# EAGLE design ESP8266 IOT Board v1.0 (EAGLE 7.7.0)
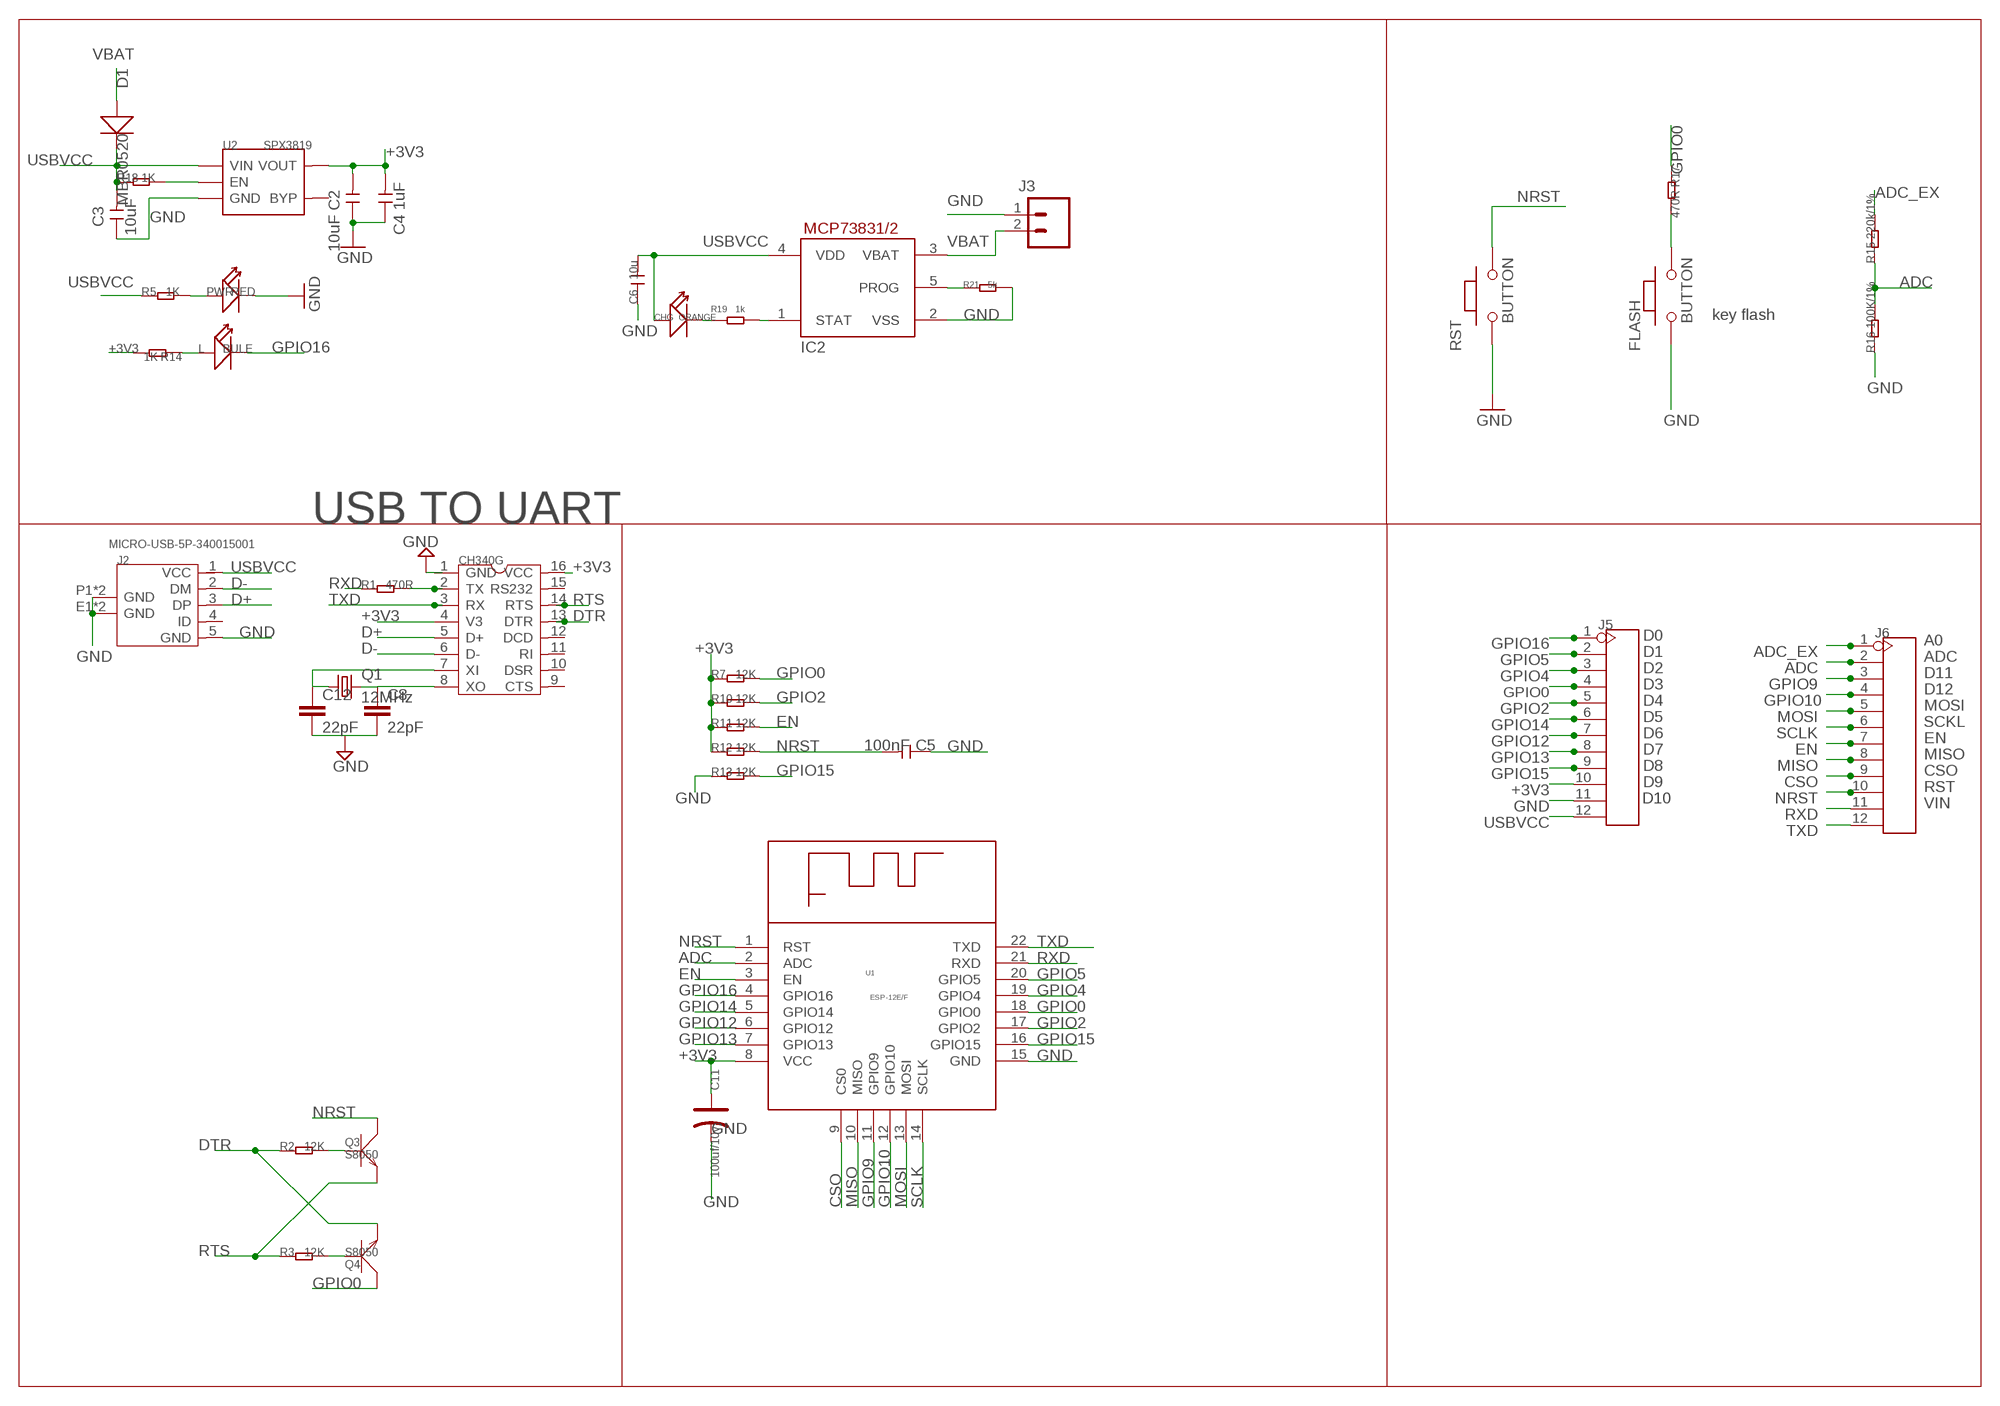
[diagram p0: schematic, sheet 1]

## Parts
C2  10uF  C-0603  [C0603]
C3  10uF  C-0603  [C0603]
C4  1uF  C-0603  [C0603]
C5  100nF  C-0603  [C0603]
C6  10u  C-0603  [C0603]
C8  22pF  CAP0603-CAP  [0603-CAP]
C11  100uf/10v  CAP-AVX-B  [AVX-B]
C12  22pF  CAP0603-CAP  [0603-CAP]
CH340G  CH340GCH340G  [SOP-16]
CHG  ORANGE  007-LED0603  [D0603]
D1  MBR0520  D'1206'  [SOD123]
FLASH  BUTTON  PB157  [157SW]
IC2  MCP73831/OT  [SOT23-5L]
J2  MICRO-USB-5P-340015001  [B-SMD-5P]
J3  M02-JST-2MM-SMT  [JST-2-SMD]
J5  HEADER-12P-2.54  [12P-2.54]
J6  HEADER-12P-2.54  [12P-2.54]
L  BULE  LED'0603'  [LED-0603]
PWR  RED  LED'0603'  [LED-0603]
Q1  12MHz  CRYSTALHC49U70  [HC49U70]
Q3  S8050  TRANSISTOR-NPN-SOT23  [SOT23]
Q4  S8050  TRANSISTOR-NPN-SOT23  [SOT23]
R1  470R  R-0603  [R0603]
R2  12K  R-0603  [R0603]
R3  12K  R-0603  [R0603]
R5  1K  R-0603  [R0603]
R7  12K  R-0603  [R0603]
R10  12K  R-0603  [R0603]
R11  12K  R-0603  [R0603]
R12  12K  R-0603  [R0603]
R13  12K  R-0603  [R0603]
R14  1K  R-0603  [R0603]
R15  220k/1%  R-0603  [R0603]
R16  100K/1%  R-0603  [R0603]
R17  470R  R-0603  [R0603]
R18  1K  R-0603  [R0603]
R19  1k  R-0603  [R0603]
R21  5k  R-0603  [R0603]
RST  BUTTON  PB157  [157SW]
U1  ESP-12E/F  [ESP-12E/F]
U2  SPX3819  [SOT23-5]

## Nets
+3V3: C2.2 C4.2 C11.+ CH340G.4(V3) CH340G.16(VCC) J5.10 R7.1 R10.1 R11.1 R12.1 R14.2 U1.8(VCC) U2.5(VOUT)
ADC: J6.2 R15.1 R16.2 U1.2(ADC)
ADC_EX: J6.1 R15.2
CSO: J6.9 U1.9(CS0)
D+: CH340G.5(D+) J2.3(DP)
D-: CH340G.6(D-) J2.2(DM)
DTR: CH340G.13(DTR) Q4.2(E) R2.1
EN: J6.7 R11.2 U1.3(EN)
GND: C2.1 C3.1 C4.1 C5.1 C6.1 C8.2 C11.- C12.2 CH340G.1(GND) FLASH.1 IC2.2(VSS) J2.5(GND) J2.E1(GND) J2.E2(GND) J2.P1(GND) J2.P2(GND) J3.1 J5.11 PWR.- R13.1 R16.1 R21.2 RST.1 U1.15(GND) U2.2(GND)
GPIO0: J5.4 Q4.3(C) R7.2 R17.1 U1.18(GPIO0)
GPIO2: J5.5 R10.2 U1.17(GPIO2)
GPIO4: J5.3 U1.19(GPIO4)
GPIO5: J5.2 U1.20(GPIO5)
GPIO9: J6.3 U1.11(GPIO9)
GPIO10: J6.4 U1.12(GPIO10)
GPIO12: J5.7 U1.6(GPIO12)
GPIO13: J5.8 U1.7(GPIO13)
GPIO14: J5.6 U1.5(GPIO14)
GPIO15: J5.9 R13.2 U1.16(GPIO15)
GPIO16: J5.1 L.- U1.4(GPIO16)
MISO: J6.8 U1.10(MISO)
MOSI: J6.5 U1.13(MOSI)
N$1: CHG.- R19.1
N$2: L.+ R14.1
N$3: PWR.+ R5.2
N$4: CH340G.2(TX) R1.2
N$5: R18.2 U2.3(EN)
N$8: FLASH.2 R17.2
N$9: Q3.1(B) R2.2
N$10: Q4.1(B) R3.2
N$20: IC2.1(STAT) R19.2
N$31: IC2.5(PROG) R21.1
NRST: C5.2 J6.10 Q3.3(C) R12.2 RST.2 U1.1(RST)
RTS: CH340G.14(RTS) Q3.2(E) R3.1
RXD: J6.11 R1.1 U1.21(RXD)
SCLK: J6.6 U1.14(SCLK)
TXD: CH340G.3(RX) J6.12 U1.22(TXD)
USBVCC: C3.2 C6.2 CHG.+ D1.- IC2.4(VDD) J2.1(VCC) J5.12 R5.1 R18.1 U2.1(VIN)
VBAT: D1.+ IC2.3(VBAT) J3.2
XI: C12.1 CH340G.7(XI) Q1.1
XO: C8.1 CH340G.8(XO) Q1.2
Unconnected: CH340G.9(CTS) CH340G.10(DSR) CH340G.11(RI) CH340G.12(DCD) CH340G.15(RS232) J2.4(ID) U2.4(BYP)

## Notes on the sheet
- 10k=100mA
- 5k=200mA
- 2k=500mA
- 1k=1000mA | key flash
- USB TO UART
- D0
- D1 | A0
- D2 | ADC
- D3 | D11
- D4 | D12
- D5 | MOSI
- D6 | SCKL
- D7 | EN
- D8 | MISO
- D9 | CSO
- D10 | RST
- VIN

## Library data of the parts
C2-C6 = Discrete:C*: Ceramic Capacitors
C8 C12 = SparkFun-Capacitors:CAP: Capacitor Standard 0603 ceramic capacitor, and 0.1" leaded capacitor.
C11 = Discrete:CAP*: Electrolytic Capacitors,Tantalum Capacitors and Super Capacitors
CH340G = digital-ic:CH340G: USB to Serial CH340G
CHG = Discrete:007-LED*
D1 = Discrete:D*
FLASH RST = MySMD:PB157
IC2 = adafruit:MCP73831: MCP73831/2 Miniature Single-Cell, Fully Integrated Li-Ion, Li-Polymer Charge Management Controllers. Nice and small simple lipoly charge controller, with adjustable current and status output (LED) http://www.ladyada.net/library/pcb/eaglelibrary.html
J2 = OPL Eagle Library:MICRO-USB-5P: ST-USB-001E：MICRO USB B SMD R/A
J3 = SparkFun:M02: Header 2 Standard 2-pin 0.1" header. Use with straight break away headers (SKU : PRT-00116), right angle break away headers (PRT-00553), swiss pins (PRT-00743), machine pins (PRT-00117), and female headers (PRT-00115). Molex polarized connector foot print use with SKU : PRT-08233 with associated crimp pins and housings.
J5 J6 = Connector:HEADER-12P
L PWR = Discrete:LED*
Q1 = crystal:CRYSTAL: CRYSTAL; OC_FARNELL: unknown; OC_NEWARK: unknown
Q3 Q4 = Discrete:TRANSISTOR-NPN*: NPN audion
R1-R3 R5 R7 R10-R19 R21 = Discrete:R*
U1 = Discrete:ESP-12E/F
U2 = IC:SPX3819

## Net classes
1 power: width 0.61 mm, drill 0.61 mm, clearance 0.254 mm
2 gnd: width 0.305 mm, drill 0.559 mm, clearance 0.254 mm
3 usbvcc: width 0.254 mm, drill 0.61 mm, clearance 0.254 mm
4 aref: width 0.406 mm, drill 0.61 mm, clearance 0.254 mm

## Board
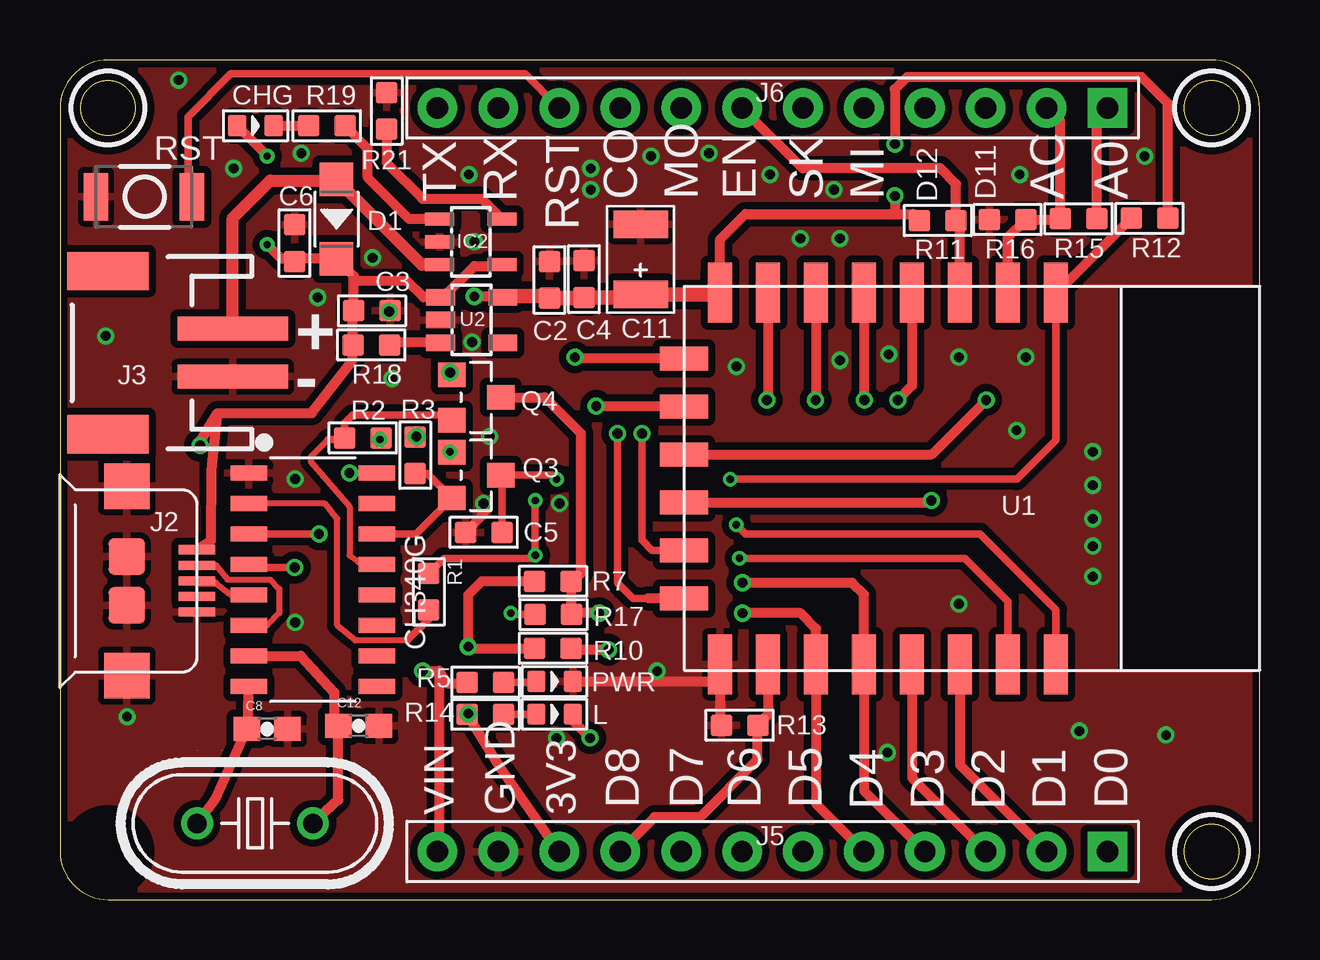
[diagram p1: board, top side]
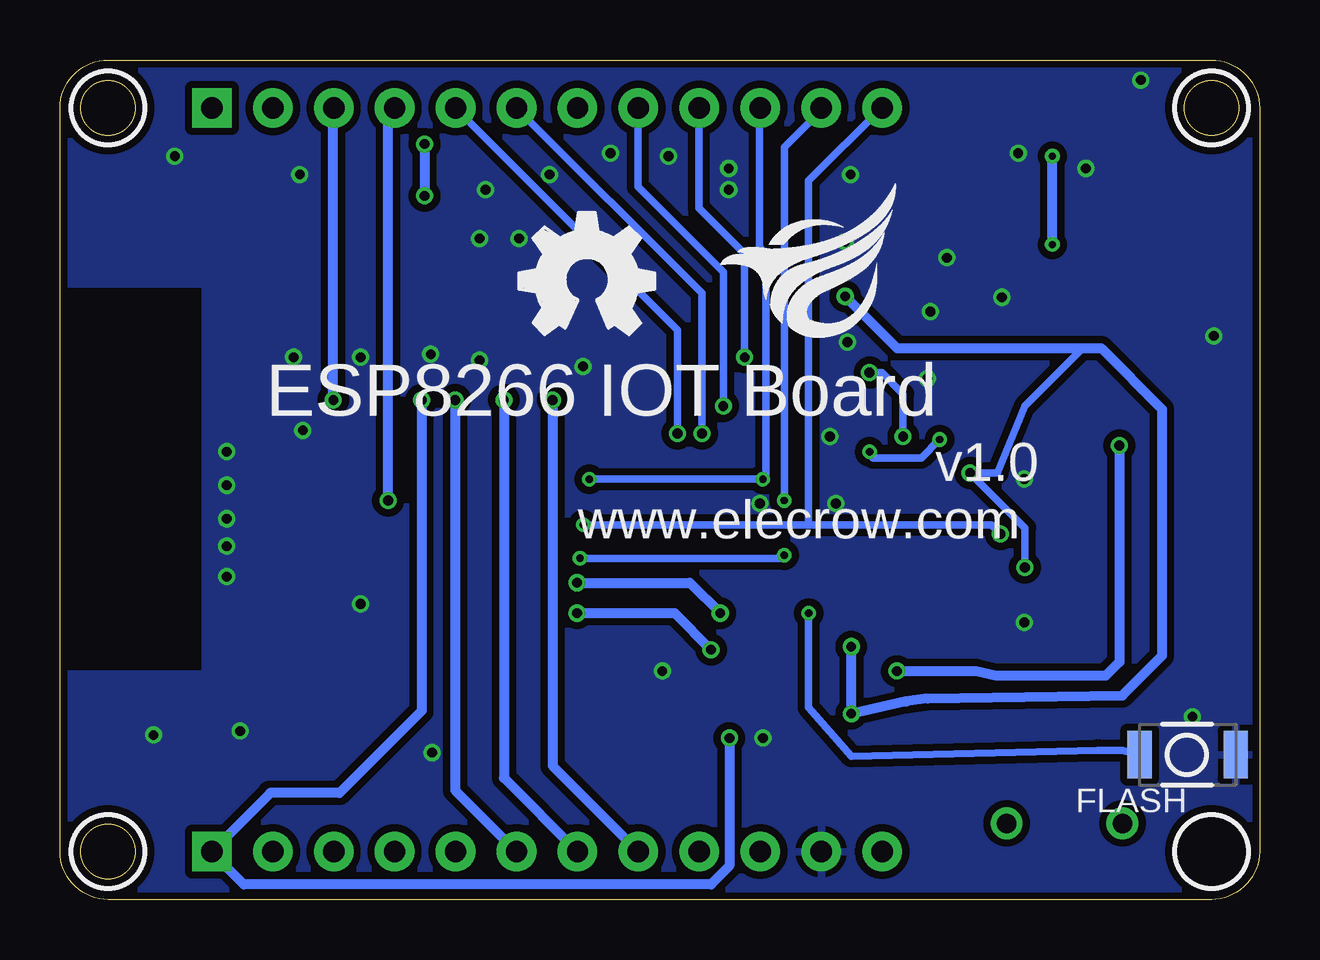
[diagram p2: board, bottom side, seen from below]

Size 50 x 35 mm. Coordinates in mm from the lower left corner, seen from the top.
Outline: 0,33 0,2 arc90 2,0 48,0 arc90 50,2 50,33 arc90 48,35 2,35 arc90 0,33
Outline: circle at 2,33 radius 1.14
Outline: circle at 48,33 radius 1.14
Outline: circle at 48,2 radius 1.14
Copper layers (1*16): Top 0.035mm / dielectric 1.5mm / Bottom 0.035mm
Design rules "SeeedStudio_2layer_DRU_no_angle_20140221": minimum track width 6mil, minimum drill 12mil, track to track 6mil, track to pad 6mil, pad to pad 6mil, via to via 6mil, smd to smd 0mil, copper to edge 10mil, drill to drill 10mil, minimum pad ring 10mil, minimum via ring 6mil, stop-mask expansion 2mil, vias tented up to drill 100mil, thermal gap 10mil
tRestrict: area 0.5,31.5 to 3.5,34.5; area 46.5,31.5 to 49.5,34.5; area 46.5,0.5 to 49.5,3.5; area 0.5,0.5 to 3.5,3.5
bRestrict: area 0.5,31.5 to 3.5,34.5; area 46.5,31.5 to 49.5,34.5; area 46.5,0.5 to 49.5,3.5; area 0.5,0.5 to 3.5,3.5

### Footprints (pad centres in the part's own frame; a part is rotated, then mirrored left to right if it is on the bottom)
C0603 = smd 0.889 x 0.889: 1 -0.762,0; 2 0.762,0
0603-CAP = smd 1.1 x 1: 1 -0.85,0; 2 0.85,0
AVX-B = smd 1.143 x 2.286: + -1.46,0; - 1.46,0
SOP-16 = smd 0.635 x 1.524: 1 -4.445,-2.667; 2 -3.175,-2.667; 3 -1.905,-2.667; 4 -0.635,-2.667; 5 0.635,-2.667; 6 1.905,-2.667; 7 3.175,-2.667; 8 4.445,-2.667; 9 4.445,2.667; 10 3.175,2.667; 11 1.905,2.667; 12 0.635,2.667; 13 -0.635,2.667; 14 -1.905,2.667; 15 -3.175,2.667; 16 -4.445,2.667
D0603 = smd 0.762 x 0.889: + -0.762,0; - 0.762,0
SOD123 = smd 1.397 x 1.397: + -1.651,0; - 1.651,0
157SW = smd 1.016 x 1.981: 1 0,0; 2 4,0
SOT23-5L = smd 0.55 x 1.2: 1 -0.95,-1.3; 2 0,-1.3; 3 0.95,-1.3; 4 0.95,1.3; 5 -0.95,1.3
B-SMD-5P = smd 0.38 x 1.52: 1 -1.3,2.54; 2 -0.65,2.54; 3 0,2.54; 4 0.65,2.54; 5 1.3,2.54 | smd 1.524 x 1.524: E1 -1.016,-0.381; E2 1.016,-0.381 | smd 1.9 x 1.9: P1 -3.95,-0.381; P2 3.95,-0.381
JST-2-SMD = smd 1 x 4.6: 1 -1,-3.7; 2 1,-3.7 | smd 1.6 x 3.4: NC1 -3.4,1.5; NC2 3.4,1.5
12P-2.54 = drill 0.889 pad 1.651 square: 1 0,13.97 | drill 0.889 pad 1.651: 2 0,11.43; 3 0,8.89; 4 0,6.35; 5 0,3.81; 6 0,1.27; 7 0,-1.27; 8 0,-3.81; 9 0,-6.35; 10 0,-8.89; 11 0,-11.43; 12 0,-13.97
LED-0603 = smd 0.762 x 0.889: + -0.762,0; - 0.762,0
HC49U70 = drill 0.813: 1 -2.413,0; 2 2.413,0
SOT23 = smd 1.016 x 1.143: 1 -0.95,-1.016; 2 0.95,-1.016; 3 0,1.016
R0603 = smd 0.889 x 0.889: 1 -0.762,0; 2 0.762,0
ESP-12E/F = smd 2.5 x 1: 1 0.25,15.5; 2 0.25,13.5; 3 0.25,11.5; 4 0.25,9.5; 5 0.25,7.5; 6 0.25,5.5; 7 0.25,3.5; 8 0.25,1.5; 15 15.75,1.5; 16 15.75,3.5; 17 15.75,5.5; 18 15.75,7.5; 19 15.75,9.5; 20 15.75,11.5; 21 15.75,13.5; 22 15.75,15.5 | smd 1 x 2: 9 3,0; 10 5,0; 11 7,0; 12 9,0; 13 11,0; 14 13,0
SOT23-5 = smd 0.69 x 1.2: 1 -0.95,-1.3; 2 0,-1.3; 3 0.95,-1.3; 4 0.95,1.3; 5 -0.95,1.3

### Placement (x,y rotation side)
C2  20.41,25.83 270 top
C3  13,24.54 180 top
C4  21.84,25.86 270 top
C5  17.66,15.31 0 top
C6  9.77,27.37 270 top
C8  8.64,7.11 0 top
C11  24.21,26.69 90 top
C12  12.45,7.24 0 top
CH340G  10.54,13.34 270 top
CHG  8.15,32.26 0 top
D1  11.53,28.36 270 top
FLASH  0.99,6.04 180 bottom
IC2  17.13,27.41 270 top
J2  3.17,13.28 270 top
J3  3.5,22.8 90 top
J5  29.7,2 270 top
J6  29.7,33 270 top
L  20.61,7.73 0 top
PWR  20.61,9.09 0 top
Q1  8.13,3.17 180 top
Q3  17.35,17.69 270 top
Q4  17.35,20.93 270 top
R1  15.37,12.83 270 top
R2  12.62,19.25 0 top
R3  14.8,18.53 90 top
R5  17.73,9.06 0 top
R7  20.55,13.27 0 top
R10  20.55,10.47 0 top
R11  36.59,28.31 0 top
R12  45.41,28.4 180 top
R13  28.33,7.27 0 top
R14  17.73,7.72 180 top
R15  42.45,28.38 0 top
R16  39.5,28.35 0 top
R17  20.56,11.88 180 top
R18  12.97,23.12 0 top
R19  11.12,32.25 0 top
R21  13.62,32.87 90 top
RST  1.5,29.3 0 top
U1  26.02,25.56 270 top
U2  17.16,24.16 270 top
U$2  [OSHW_FILLX200_NOTEXT]  30.87,23.55 0 bottom
U$4  [ELECROW_NRW_6]  22.48,23.43 0 bottom

### Tracks (layer width: path | path; a pad name or v marks a point on that pad's centre or on a via)
+3V3  (via drill 0.41)
  Top 0.305: R10.1 18.23,10.47 | 19.73,13.21 R7.1 | v17.02,7.75 16.81,7.87 R14.2 | CH340G.16 v12.06,17.78 | v9.78,13.84 8.26,13.84 CH340G.4
  Top 0.406: R14.2 18.37,5.46 J5.10 | R10.1 17.21,10.47 v17.02,10.54 17.02,12.7 17.58,13.27 R7.1 | U1.8 27.52,25.91 27.52,27.52 28.57,28.57 34.8,28.57 | 34.8,28.57 35.56,28.57 R11.1 | v34.8,31.5 34.8,33.78 35.31,34.29 45.09,34.29 46.17,33.2 R12.1 | v34.8,29.34 34.8,28.57 | v17.27,25.15 18.37,25.15 U2.5 18.55,25.15
  Top 0.61: 27.31,26.12 27.52,25.91 | U1.8 27.44,25.23 C11.+ 24.08,25.1 C4.2 21.8,25.07 C2.2 20.33,25.15 18.55,25.15
  Bottom 0.305: 7.37,22.99 9.78,20.57 10.92,17.78 v12.06,17.78 9.78,15.49 v9.78,13.84
  Bottom 0.406: v17.02,10.54 v17.02,7.75 14.73,8.26 13.84,8.38 5.71,8.51 4.06,10.16 4.06,20.45 6.6,22.99 7.37,22.99 15.11,22.99 v17.27,25.15 | v34.8,31.5 v34.8,29.34
ADC
  Top 0.406: U1.2 39.52,27.61 R16.2 41.66,28.35 R15.1 41.69,32.47 41.66,32.47 J6.2
ADC_EX
  Top 0.406: R15.2 43.22,32.52 43.67,32.97 J6.1
CSO  (via drill 0.41)
  Top 0.406: U1.9 21.51,22.56 v21.46,22.61
  Bottom 0.305: v21.46,22.61 21.46,26.92 23.37,28.83 23.37,32.98 J6.9
D+
  Top 0.254: CH340G.5 7.11,12.7 6.48,13.21
  Top 0.305: 6.48,13.21 5.78,13.21 J2.3
D-
  Top 0.254: J2.2 6.51,13.93 6.99,13.34 8.76,13.34 9.14,12.95 9.14,11.94 8.64,11.43 CH340G.6
DTR
  Top 0.254: 11.18,19.18 10.45,18.45 10.45,18.25 12.06,16.38 12.06,14.35 12.45,14.1
  Top 0.305: 11.18,19.18 11.79,19.18 R2.1 11.86,19.86 12.19,20.19 16.12,20.19 Q4.2 | 12.45,14.1 13.34,14.1 CH340G.13
EN
  Top 0.406: U1.3 37.52,28.14 R11.2 37.35,29.83 36.7,30.48 30.95,30.48 J6.7
GND  (via drill 0.41)
  Top 0.406: U1.15 27.52,9.14 | 27.52,9.14 27.52,7.32 R13.1 | PWR.- 27.46,9.09 27.52,9.14 | v17.65,16.51 17.65,16.06 C5.1
  Top 0.61: 13.77,24.67 C3.1 13.75,24.67 v13.72,24.51
  other vias: 17.27,27.43 22.12,30.48 24.89,9.53 27.05,31.11 43.05,18.67 43.05,17.27 43.05,15.88 43.05,14.73 43.05,13.46 29.59,30.23 39.88,19.56 40.01,30.23 28.19,22.23 7.24,30.48 4.95,34.16 10.74,25.1 32.51,22.48 34.54,22.73 37.47,22.61 40.26,22.61 32.26,29.59 32.51,27.56 2.79,7.62 20.7,6.73 37.47,12.32 46.1,6.86 13.84,21.72 1.91,23.5 30.86,27.56 34.49,6.12 42.49,7.03 13.03,26.75 17.91,19.3 20.83,16.51 17.05,30.23 22.12,29.59 17.17,23.24 9.81,17.53 9.81,11.56 10.06,31.11 45.21,30.99 24.64,30.99
  pour Top (isolate 0.305, rank 2): -0.13,35.43 50.29,35.43 50.29,25.65 43.94,25.65 43.94,9.4 50.04,9.4 50.04,0 -0.13,0
  pour Bottom (isolate 0.305, rank 2): -0.13,35.43 50.29,35.43 50.29,25.65 43.94,25.65 43.94,9.4 50.04,9.4 50.04,0 -0.13,0
GPIO0  (via drill 0.41)
  Top 0.406: v28.45,13.21 33.02,13.21 33.52,12.71 U1.18 33.52,4.53 J5.4 | v22.48,11.94 21.38,11.94 R17.1 21.33,13.25 R7.2 21.39,13.27 21.72,13.59 21.72,19.43 20.21,20.93 Q4.3
  Bottom 0.406: v28.45,13.21 23.75,13.21 v22.48,11.94
GPIO2  (via drill 0.41)
  Top 0.406: v28.45,11.94 30.86,11.94 31.52,11.28 U1.17 31.52,3.99 J5.5 | v22.86,10.41 21.37,10.41 R10.2
  Bottom 0.406: v28.45,11.94 24.38,11.94 v22.86,10.41
GPIO4
  Top 0.406: U1.19 35.52,5.07 J5.3
GPIO5
  Top 0.406: U1.20 37.52,5.61 J5.2
GPIO9  (via drill 0.41)
  Top 0.406: U1.11 36.34,18.56 v38.61,20.83
  Bottom 0.406: v38.61,20.83 38.61,32.99 38.6,32.99 J6.3
GPIO10  (via drill 0.41)
  Top 0.406: U1.12 36.24,16.56 v36.32,16.64
  Bottom 0.406: v36.32,16.64 36.32,32.76 36.29,32.76 J6.4
GPIO12  (via drill 0.41)
  Top 0.406: U1.6 31.52,21.1 v31.5,20.83
  Bottom 0.406: v31.5,20.83 31.5,5.07 J5.7
GPIO13  (via drill 0.41)
  Top 0.406: U1.7 29.52,20.88 v29.46,20.83
  Bottom 0.406: J5.8 29.46,5.57 v29.46,20.83
GPIO14  (via drill 0.41)
  Top 0.406: U1.5 33.52,20.84 v33.53,20.83
  Bottom 0.406: v33.53,20.83 33.53,4.56 J5.6
GPIO15
  Top 0.406: U1.16 29.52,7.69 R13.2 29.08,5.84 26.67,3.43 24.78,3.43 J5.9
GPIO16  (via drill 0.41)
  Top 0.406: U1.4 35.52,21.42 v34.92,20.83 | L.- 21.38,7.45 v22.1,6.73
  Bottom 0.406: v34.92,20.83 34.92,7.87 38.35,4.45 41.26,4.45 41.26,4.42 J5.1 43.67,1.97 42.34,0.64 22.86,0.64 22.1,1.4 v22.1,6.73
MISO  (via drill 0.41)
  Top 0.406: U1.10 22.37,20.56 v22.35,20.57
  Bottom 0.305: v22.35,20.57 22.35,26.16 25.91,29.72 25.91,32.98 J6.8
MOSI  (via drill 0.41)
  Top 0.305: U1.13 24.69,14.56 24.26,14.99 v24.26,19.43
  Bottom 0.305: v24.26,19.43 24.26,23.75 J6.5
N$1
  Top 0.406: CHG.- R19.1
N$2
  Top 0.305: R14.1 19.84,7.72 L.+
N$3
  Top 0.305: R5.2 19.82,9.06 PWR.+
N$4
  Top 0.254: 14.48,10.79 12.32,10.79 11.56,11.43 11.56,15.88 11.05,16.51 CH340G.2
  Top 0.305: R1.2 15.37,11.68 14.48,10.79
N$5
  Top 0.406: U2.3 13.82,23.21 R18.2
N$8  (via drill 0.3)  (2 unrouted)
  Top 0.305: R17.2 18.85,11.88 v18.8,11.94
  Bottom 0.305: FLASH.2 5.72,6.22 6.73,6.22 17.02,5.97 18.8,8 v18.8,11.94
N$9  (via drill 0.3)
  Top 0.305: R2.2 13.28,19.25 v13.34,19.18 | v16.26,18.67 16.26,18.56 Q3.1
  Bottom 0.305: v13.34,19.18 14.1,18.41 16.11,18.41 Q3.1 16.29,18.64 v16.26,18.67
N$10  (via drill 0.41)
  Top 0.305: Q4.1 16.34,22.01 v16.26,21.97 | v14.86,19.3 14.82,19.3 R3.2
  Bottom 0.305: v14.86,19.3 14.86,21.08 15.75,21.97 v16.26,21.97
N$20
  Top 0.406: IC2.1 14.56,28.36 12.83,30.1 12.83,31.31 R19.2
N$31
  Top 0.406: R21.1 13.62,30.7 15.11,29.21 17.58,29.21 IC2.5
NRST  (via drill 0.3)
  Top 0.305: RST.2 5.33,29.17 5.33,32.64 7.11,34.42 19.39,34.42 J6.10 | C5.2 18.42,17.64 Q3.3 20.54,17.69 v20.7,17.53 | U1.1 41.52,19.16 39.88,17.53 v27.94,17.53
  Top 0.406: U1.1 41.56,25.31 R12.2
  Bottom 0.305: v27.94,17.53 v20.7,17.53 20.57,17.65 20.57,26.92 20.84,27.19 20.84,32.97 J6.10
RTS
  Top 0.305: CH340G.14 14.84,15.24 Q3.2 15.31,17.77 R3.1
RXD  (via drill 0.3)
  Top 0.305: U1.21 39.52,12.43 37.72,14.22 v28.32,14.22 28.19,14.22 | v19.81,16.64 v19.81,14.35 19.68,14.22 16,14.22 R1.1
  Bottom 0.305: J6.11 18.27,32.91 19.81,31.37 v19.81,16.64 | v28.32,14.22 19.94,14.22 v19.81,14.35
SCLK  (via drill 0.41)
  Top 0.305: 24.53,12.56 23.89,12.56 23.24,13.21 v23.24,19.43
  Top 0.406: U1.14 24.53,12.56
  Bottom 0.305: v23.24,19.43 23.24,25.27 J6.6
TXD  (via drill 0.3, 0.41)
  Top 0.305: U1.22 41.52,12.08 38.35,15.24 28.57,15.24 v28.19,15.62 | CH340G.3 v10.79,15.24
  Bottom 0.305: v28.19,15.62 18.8,15.62 | 18.8,15.62 15.49,15.62 15.38,15.62 11.18,15.62 v10.79,15.24 | J6.12 15.77,33 18.8,29.97 18.8,15.62
USBVCC  (via drill 0.3, 0.41)
  Top 0.254: 15.81,2.08 J5.12
  Top 0.406: 12.19,23.74 12.19,22.48 10.5,20.28 6.57,20.28 | 12.19,23.74 R18.1 | v5.84,18.92 5.8,19.01 6.57,20.28 | J2.1 6.29,14.96 6.31,17.91 6.57,20.28 | 12.19,23.74 12.19,24.62 C3.2 12.24,25.78 | 12.24,25.78 12.24,26 D1.- 9.88,26.71 | 9.88,26.71 C6.2 | 12.24,25.78 14.48,25.78 15.15,25.11 U2.1 15.97,25.11 17.27,26.42 18.38,26.42 IC2.4 | 9.88,26.71 9.23,26.71 v8.64,27.3 | v8.64,30.99 8.64,31.01 CHG.+ | R5.1 16.93,9.02 16.13,9.02 15.81,9.54 | v15.11,9.53 15.32,9.53 15.81,9.54 | 15.81,9.54 15.81,2.08
  Bottom 0.406: v15.11,9.53 11.81,9.53 10.99,9.34 6.41,9.34 5.84,9.91 v5.84,18.92 | v8.64,27.3 v8.64,30.99
VBAT
  Top 0.406: 11.57,29.97 D1.+
  Top 0.508: J3.2 7.2,28.41 8.76,29.97 11.49,29.97 D1.+ 15.08,26.46 IC2.3
XI
  Top 0.406: CH340G.7 10.03,10.16 11.43,8.64 11.43,7.58 C12.1 11.6,4.15 Q1.1
XO
  Top 0.406: CH340G.8 7.83,7.66 C8.1 6.44,4.15 Q1.2

### Text on the board
tPlace: + | -
tNames: TX | RX | CO | MO | EN | SK | MI | D12 | D11 | AC | A0 | RST | VIN | GND | 3V3 | D8 | D7 | D6 | D5 | D4 | D3 | D2 | D1 | D0
bNames: ESP8266 IOT Board | v1.0 | www.elecrow.com
214bmp: D:/SmartProjects/Snc/a4_bn_logo2.bmp